# EAGLE schematic MotorController (EAGLE 9.1.0)
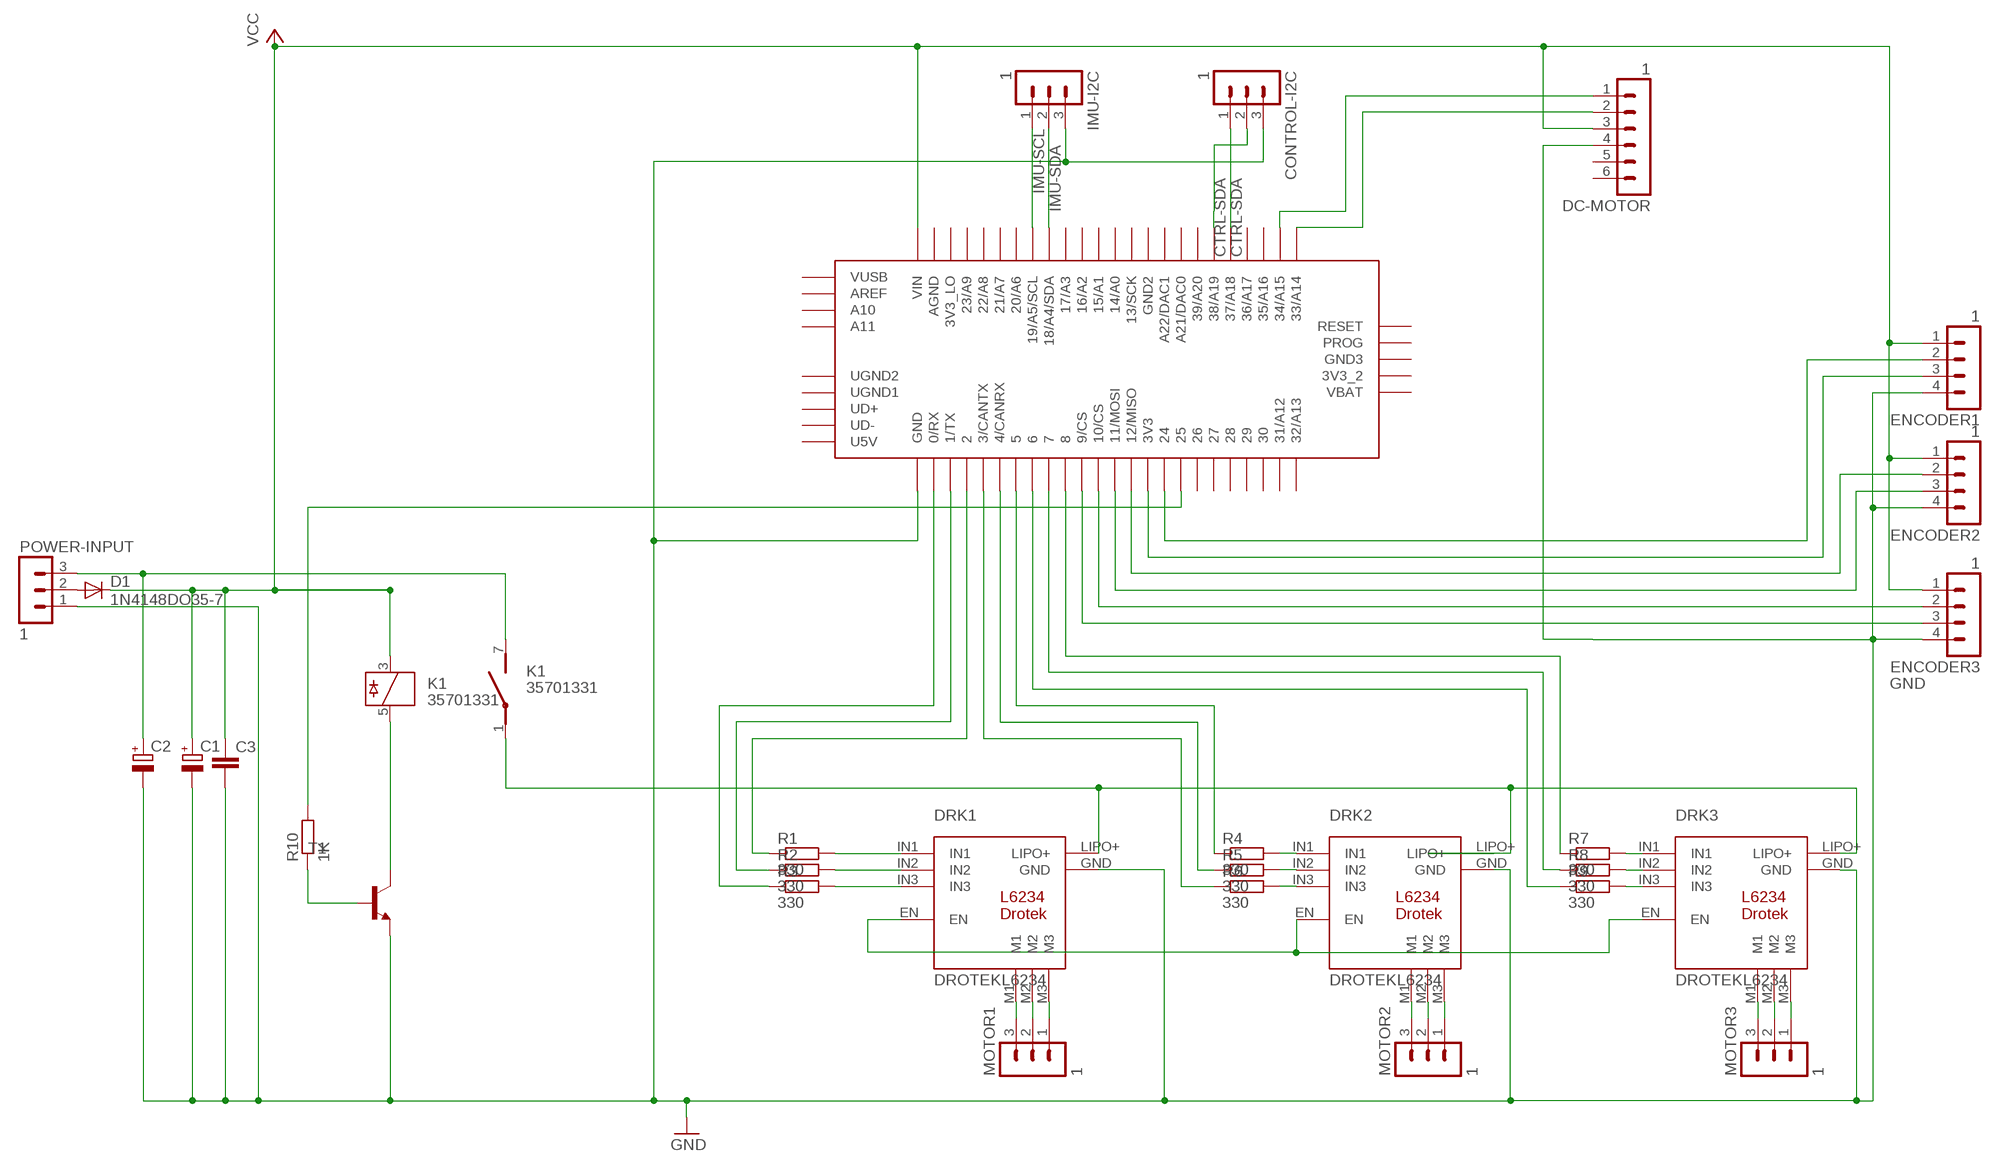
[diagram p0: schematic, sheet 1]

## Parts
C1  CPOL-EUE7.5-16  [E7,5-16]
C2  CPOL-EUE7.5-16  [E7,5-16]
C3  C2.5/2  [C2.5-2]
CONTROL-I2C  1  MA03-1  [MA03-1]
D1  1N4148DO35-7  [DO35-7]
DC-MOTOR  1  MA06-1  [MA06-1]
DRK1  DROTEKL6234  [DROTEKL6234]
DRK2  DROTEKL6234  [DROTEKL6234]
DRK3  DROTEKL6234  [DROTEKL6234]
ENCODER1  1  MA04-1  [MA04-1]
ENCODER2  1  MA04-1  [MA04-1]
ENCODER3  1  MA04-1  [MA04-1]
IMU-I2C  1  MA03-1  [MA03-1]
K1  35701331  [REED]
MOTOR1  1  MA03-1  [MA03-1]
MOTOR2  1  MA03-1  [MA03-1]
MOTOR3  1  MA03-1  [MA03-1]
POWER-INPUT  1  MA03-1  [MA03-1]
PRJ1  TEENSY_3.5/3.6  [TEENSY_3.5/3.6]
R1  330  R-EU_0204/7  [0204/7]
R2  330  R-EU_0204/7  [0204/7]
R3  330  R-EU_0204/7  [0204/7]
R4  330  R-EU_0204/7  [0204/7]
R5  330  R-EU_0204/7  [0204/7]
R6  330  R-EU_0204/7  [0204/7]
R7  330  R-EU_0204/7  [0204/7]
R8  330  R-EU_0204/7  [0204/7]
R9  330  R-EU_0204/7  [0204/7]
R10  1K  R-EU_0204/7  [0204/7]
T1  -NPN-TO92  [TO92]

## Nets
CTRL-SDA: CONTROL-I2C.1 PRJ1.37/A18
GND: C1.- C2.- C3.2 CONTROL-I2C.3 DC-MOTOR.4 DRK1.GND DRK2.GND DRK3.GND ENCODER1.4 ENCODER2.4 ENCODER3.4 IMU-I2C.3 POWER-INPUT.1 PRJ1.GND T1.1(E)
IMU-SCL: IMU-I2C.1 PRJ1.19/A5/SCL
IMU-SDA: IMU-I2C.2 PRJ1.18/A4/SDA
N$1: DRK1.M1 MOTOR1.3
N$2: DRK1.M2 MOTOR1.2
N$3: DRK1.M3 MOTOR1.1
N$4: DRK1.IN1 R1.2
N$5: DRK1.IN2 R2.2
N$6: DRK1.IN3 R3.2
N$7: PRJ1.2 R1.1
N$8: PRJ1.1/TX R2.1
N$9: PRJ1.0/RX R3.1
N$10: DRK1.EN DRK2.EN DRK3.EN
N$11: DRK2.IN1 R4.2
N$12: DRK1.LIPO+ DRK2.LIPO+ DRK3.LIPO+ K1.1(2:P)
N$13: DRK2.M1 MOTOR2.3
N$14: DRK2.M2 MOTOR2.2
N$15: DRK2.M3 MOTOR2.1
N$16: DRK3.M1 MOTOR3.3
N$17: DRK3.M2 MOTOR3.2
N$18: DRK3.M3 MOTOR3.1
N$19: DRK2.IN2 R5.2
N$20: DRK2.IN3 R6.2
N$21: PRJ1.3/CANTX R6.1
N$22: PRJ1.4/CANRX R5.1
N$23: PRJ1.5 R4.1
N$24: DRK3.IN2 R8.2
N$25: DRK3.IN1 R7.2
N$26: DRK3.IN3 R9.2
N$27: PRJ1.6 R9.1
N$28: PRJ1.7 R8.1
N$29: PRJ1.8 R7.1
N$30: R10.1 T1.2(B)
N$31: K1.5 T1.3(C)
N$32: C2.+ K1.7(2:S) POWER-INPUT.3
N$33: ENCODER3.3 PRJ1.9/CS
N$34: ENCODER3.2 PRJ1.10/CS
N$35: ENCODER2.3 PRJ1.11/MOSI
N$36: ENCODER2.2 PRJ1.12/MISO
N$37: ENCODER1.3 PRJ1.3V3
N$38: ENCODER1.2 PRJ1.24
N$39: D1.A POWER-INPUT.2
N$40: DC-MOTOR.2 PRJ1.33/A14
N$41: DC-MOTOR.1 PRJ1.34/A15
N$42: PRJ1.25 R10.2
N$43: CONTROL-I2C.2 PRJ1.38/A19
VCC: C1.+ C3.1 D1.C DC-MOTOR.3 ENCODER1.1 ENCODER2.1 ENCODER3.1 K1.3 PRJ1.VIN
Unconnected: DC-MOTOR.5 DC-MOTOR.6 PRJ1.3V3_2 PRJ1.3V3_LO PRJ1.13/SCK PRJ1.14/A0 PRJ1.15/A1 PRJ1.16/A2 PRJ1.17/A3 PRJ1.20/A6 PRJ1.21/A7 PRJ1.21/DAC0(A21/DAC0) PRJ1.22/A8 PRJ1.23/A9 PRJ1.26 PRJ1.27 PRJ1.28 PRJ1.29 PRJ1.30 PRJ1.31/A12 PRJ1.32/A13 PRJ1.35/A16 PRJ1.36/A17 PRJ1.39/A20 PRJ1.A10 PRJ1.A11 PRJ1.A22/DAC1 PRJ1.AGND PRJ1.AREF PRJ1.GND2 PRJ1.GND3 PRJ1.PROG PRJ1.RESET PRJ1.U5V PRJ1.UD+ PRJ1.UD- PRJ1.UGND1 PRJ1.UGND2 PRJ1.VBAT PRJ1.VUSB

## Library data of the parts
C1 C2 = rcl:CPOL-EU: POLARIZED CAPACITOR, European symbol; SPICEPREFIX: C
C3 = capacitor-wima:C: CAPACITOR naming: grid - package width
CONTROL-I2C IMU-I2C MOTOR1-MOTOR3 POWER-INPUT = con-lstb:MA03-1: PIN HEADER; OC_FARNELL: unknown; OC_NEWARK: unknown
D1 = diode:1N4148: DIODE high speed (Philips)
DC-MOTOR = con-lstb:MA06-1: PIN HEADER; OC_FARNELL: unknown; OC_NEWARK: unknown
DRK1-DRK3 = Drotek L6234:DROTEKL6234
ENCODER1-ENCODER3 = con-lstb:MA04-1: PIN HEADER; OC_FARNELL: unknown; OC_NEWARK: unknown
K1 = relay:35701331: RELAY reed, 1 x norm. open with polarity; OC_FARNELL: unknown; OC_NEWARK: unknown
PRJ1 = Teensy356:TEENSY_3.5/3.6
R1-R10 = resistor:R-EU_: RESISTOR, European symbol
T1 = transistor:*-NPN-: NPN Transistror BF959 corrected 2008.03.06

## Net classes
0 default: width 0.254 mm, drill 0.635 mm, clearance 1.27 mm